# EAGLE schematic Power_Board (EAGLE 6.4)
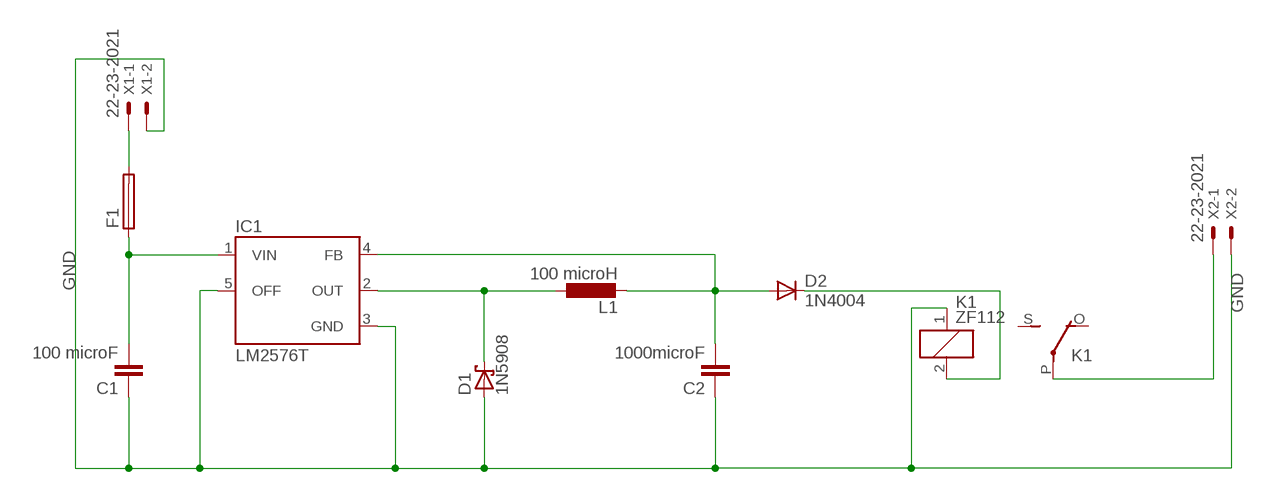
[diagram p0: schematic, sheet 1]

## Parts
C1  100 microF  C-EU050-030X075  [C050-030X075]
C2  1000microF  C-EU050-030X075  [C050-030X075]
D1  1N5908  [C4111-15]
D2  1N4004  [DO41-10]
F1  FUSESH22,5  [SH22,5]
IC1  LM2576T  [TO220-5]
K1  ZF112  [ZF112]
L1  100 microH  L-EU0204/7  [0204/7]
X1  22-23-2021  [22-23-2021]
X2  22-23-2021  [22-23-2021]

## Nets
GND [GND]: C1.1 C2.1 D1.A IC1.3(GND) IC1.5(OFF) K1.1 X1.2 X2.2
N$1 [POWER]: K1.P(2:P) X2.1
N$2 [POWER]: D2.C K1.2
N$3 [POWER]: D1.C IC1.2(OUT) L1.1
N$4 [POWER]: C2.2 D2.A IC1.4(FB) L1.2
N$5: F1.2 X1.1
VIN [POWER]: C1.2 F1.1 IC1.1(VIN)
Unconnected: K1.O(2:O) K1.S(2:S)

## Library data of the parts
C1 C2 = rcl:C-EU: CAPACITOR, European symbol
D1 = diode:1N5908: DIODE schottky
D2 = diode:1N4004: DIODE general purpose rectifier, 1 A
F1 = fuse:FUSE: Fuse; OC_FARNELL: unknown; OC_NEWARK: unknown
IC1 = v-reg-3:LM2576: National Semiconductor <http://www.national.com> 3.0A "Simple Switcher"(c) 52kHz, Vout 1.23-37V (HV: 57V), Vin 40V (HV: 60V), 50µA standby current
K1 = relay:ZF112: RELAY 1 x switch; OC_FARNELL: unknown; OC_NEWARK: unknown
L1 = rcl:L-EU: INDUCTOR, European symbol
X1 X2 = con-molex:22-23-2021: .100" (2.54mm) Center Header - 2 Pin; MF: MOLEX; MPN: 22-23-2021; OC_FARNELL: 1462926; OC_NEWARK: 25C3832

## Net classes
1 GND: width 0.61 mm, drill 0.61 mm, clearance 0.61 mm
2 POWER: width 0.61 mm, drill 0.61 mm, clearance 0.61 mm